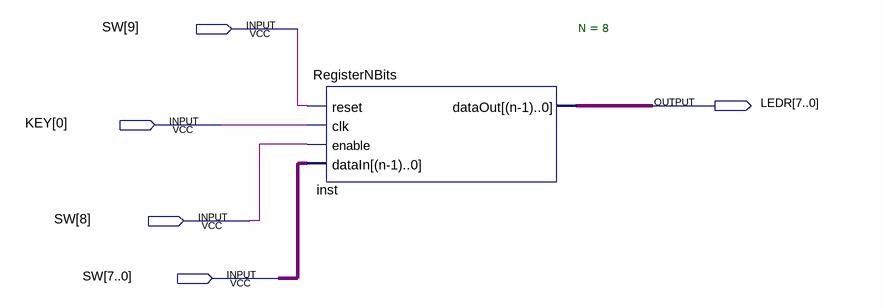
[diagram p0: schematic sheet]
// Quartus schematic Register_Demo.bdf as structural Verilog: 1 symbols, 5 pins
module Register_Demo (
  input  [9:0] SW,
  input  [0:0] KEY,
  output [7:0] LEDR
);

  RegisterNBits #(.N(8)) inst (.reset(SW[9]), .clk(KEY[0]), .enable(SW[8]), .dataIn(SW[7:0]), .dataOut(LEDR));
endmodule
